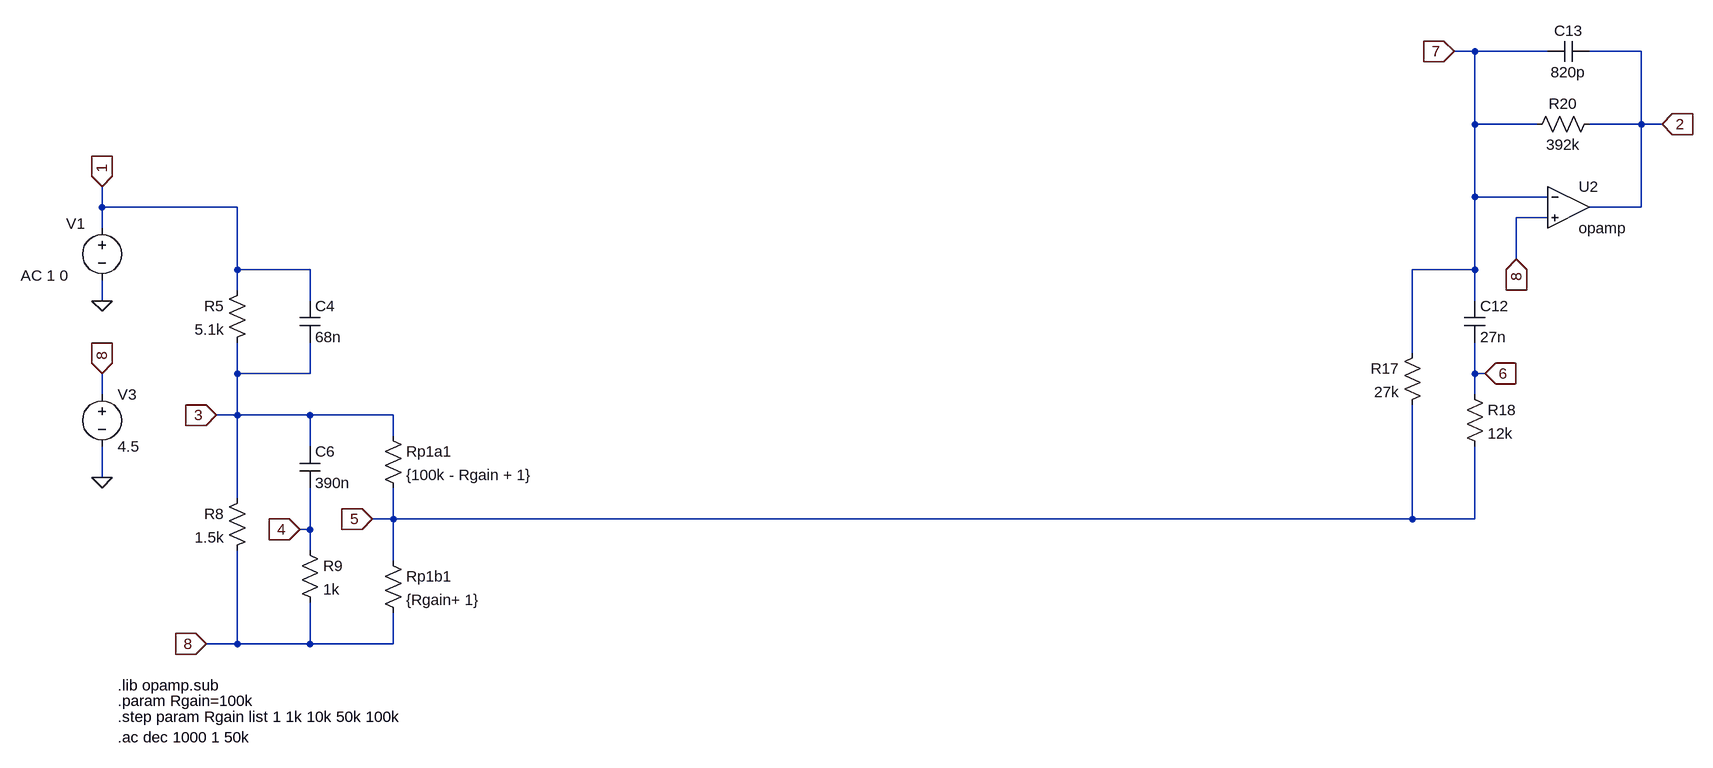
[diagram p0: schematic Klon-Centaur_sum_path_3-OLD.asc]
Klon-Centaur_sum_path_3-OLD.asc, the LTspice schematic file:
Version 4
SHEET 1 4496 5064
WIRE 1696 2320 1664 2320
WIRE 1808 2320 1696 2320
WIRE 1952 2320 1872 2320
WIRE 1696 2432 1696 2320
WIRE 1792 2432 1696 2432
WIRE 1952 2432 1952 2320
WIRE 1952 2432 1872 2432
WIRE 1984 2432 1952 2432
WIRE 1696 2544 1696 2432
WIRE 1808 2544 1696 2544
WIRE -416 2560 -416 2528
WIRE -208 2560 -416 2560
WIRE 1952 2560 1952 2432
WIRE 1952 2560 1872 2560
WIRE 1808 2576 1760 2576
WIRE -416 2592 -416 2560
WIRE 1760 2640 1760 2576
WIRE -208 2656 -208 2560
WIRE -96 2656 -208 2656
WIRE 1696 2656 1696 2544
WIRE 1696 2656 1600 2656
WIRE -208 2688 -208 2656
WIRE -416 2704 -416 2672
WIRE -96 2704 -96 2656
WIRE 1696 2704 1696 2656
WIRE 1600 2784 1600 2656
WIRE -208 2816 -208 2768
WIRE -96 2816 -96 2768
WIRE -96 2816 -208 2816
WIRE 1696 2816 1696 2768
WIRE 1712 2816 1696 2816
WIRE -416 2848 -416 2816
WIRE 1696 2848 1696 2816
WIRE -208 2880 -208 2816
WIRE -208 2880 -240 2880
WIRE -96 2880 -208 2880
WIRE 32 2880 -96 2880
WIRE 32 2912 32 2880
WIRE -96 2928 -96 2880
WIRE -416 2976 -416 2928
WIRE -208 3008 -208 2880
WIRE 32 3040 32 2992
WIRE 32 3040 0 3040
WIRE 1600 3040 1600 2864
WIRE 1600 3040 32 3040
WIRE 1696 3040 1696 2928
WIRE 1696 3040 1600 3040
WIRE -96 3056 -96 2992
WIRE -96 3056 -112 3056
WIRE -96 3088 -96 3056
WIRE 32 3104 32 3040
WIRE -208 3232 -208 3088
WIRE -208 3232 -256 3232
WIRE -96 3232 -96 3168
WIRE -96 3232 -208 3232
WIRE 32 3232 32 3184
WIRE 32 3232 -96 3232
FLAG -256 3232 8
IOPIN -256 3232 In
FLAG -416 2528 1
IOPIN -416 2528 In
FLAG 1760 2640 8
IOPIN 1760 2640 In
FLAG -416 2976 0
FLAG -416 2816 8
IOPIN -416 2816 In
FLAG -416 2704 0
FLAG 1712 2816 6
IOPIN 1712 2816 In
FLAG 0 3040 5
IOPIN 0 3040 In
FLAG -112 3056 4
IOPIN -112 3056 In
FLAG -240 2880 3
IOPIN -240 2880 In
FLAG 1664 2320 7
IOPIN 1664 2320 In
FLAG 1984 2432 2
IOPIN 1984 2432 In
SYMBOL voltage -416 2576 R0
WINDOW 0 -55 9 Left 2
WINDOW 123 -125 89 Left 2
WINDOW 39 0 0 Left 0
WINDOW 3 -289 58 Left 2
SYMATTR InstName V1
SYMATTR Value2 AC 1 0
SYMATTR Value ""
SYMBOL res -192 2672 M0
SYMATTR InstName R5
SYMATTR Value 5.1k
SYMBOL res -192 2992 M0
SYMATTR InstName R8
SYMATTR Value 1.5k
SYMBOL cap -112 2704 R0
SYMATTR InstName C4
SYMATTR Value 68n
SYMBOL cap -112 2928 R0
SYMATTR InstName C6
SYMATTR Value 390n
SYMBOL res -112 3072 R0
SYMATTR InstName R9
SYMATTR Value 1k
SYMBOL res 16 2896 R0
SYMATTR InstName Rp1a1
SYMATTR Value {100k - Rgain + 1}
SYMBOL res 16 3088 R0
SYMATTR InstName Rp1b1
SYMATTR Value {Rgain+ 1}
SYMBOL res 1616 2768 M0
SYMATTR InstName R17
SYMATTR Value 27k
SYMBOL res 1680 2832 R0
SYMATTR InstName R18
SYMATTR Value 12k
SYMBOL cap 1680 2704 R0
SYMATTR InstName C12
SYMATTR Value 27n
SYMBOL res 1888 2416 R90
WINDOW 0 0 56 VBottom 2
WINDOW 3 32 56 VTop 2
SYMATTR InstName R20
SYMATTR Value 392k
SYMBOL cap 1872 2304 R90
WINDOW 0 0 32 VBottom 2
WINDOW 3 32 32 VTop 2
SYMATTR InstName C13
SYMATTR Value 820p
SYMBOL voltage -416 2832 R0
WINDOW 123 0 0 Left 0
WINDOW 39 0 0 Left 0
SYMATTR InstName V3
SYMATTR Value 4.5
SYMBOL OpAmps\\opamp 1840 2496 R0
SYMATTR InstName U2
TEXT -392 3320 Left 2 !.param Rgain=100k
TEXT -392 3296 Left 2 !.lib opamp.sub
TEXT -392 3344 Left 2 !.step param Rgain list 1 1k 10k 50k 100k
TEXT -392 3376 Left 2 !.ac dec 1000 1 50k

The netlist it stands for:
* Klon-Centaur_sum_path_3-OLD.asc
V1 1 0 AC 1 0
R5 1 3 5.1k
R8 3 8 1.5k
C4 1 3 68n
C6 3 4 390n
R9 4 8 1k
Rp1a1 3 5 {100k - Rgain + 1}
Rp1b1 5 8 {Rgain+ 1}
R17 7 5 27k
R18 6 5 12k
C12 7 6 27n
R20 2 7 392k
C13 2 7 820p
V3 8 0 4.5
XU2 7 8 2 opamp Aol=100K GBW=10Meg  ; pins invin noninvin out
.param Rgain=100k
.lib opamp.sub
.step param Rgain list 1 1k 10k 50k 100k
.ac dec 1000 1 50k
.backanno
.end